# EAGLE design 153-03D LCNC IO expander (EAGLE 6.6.0)
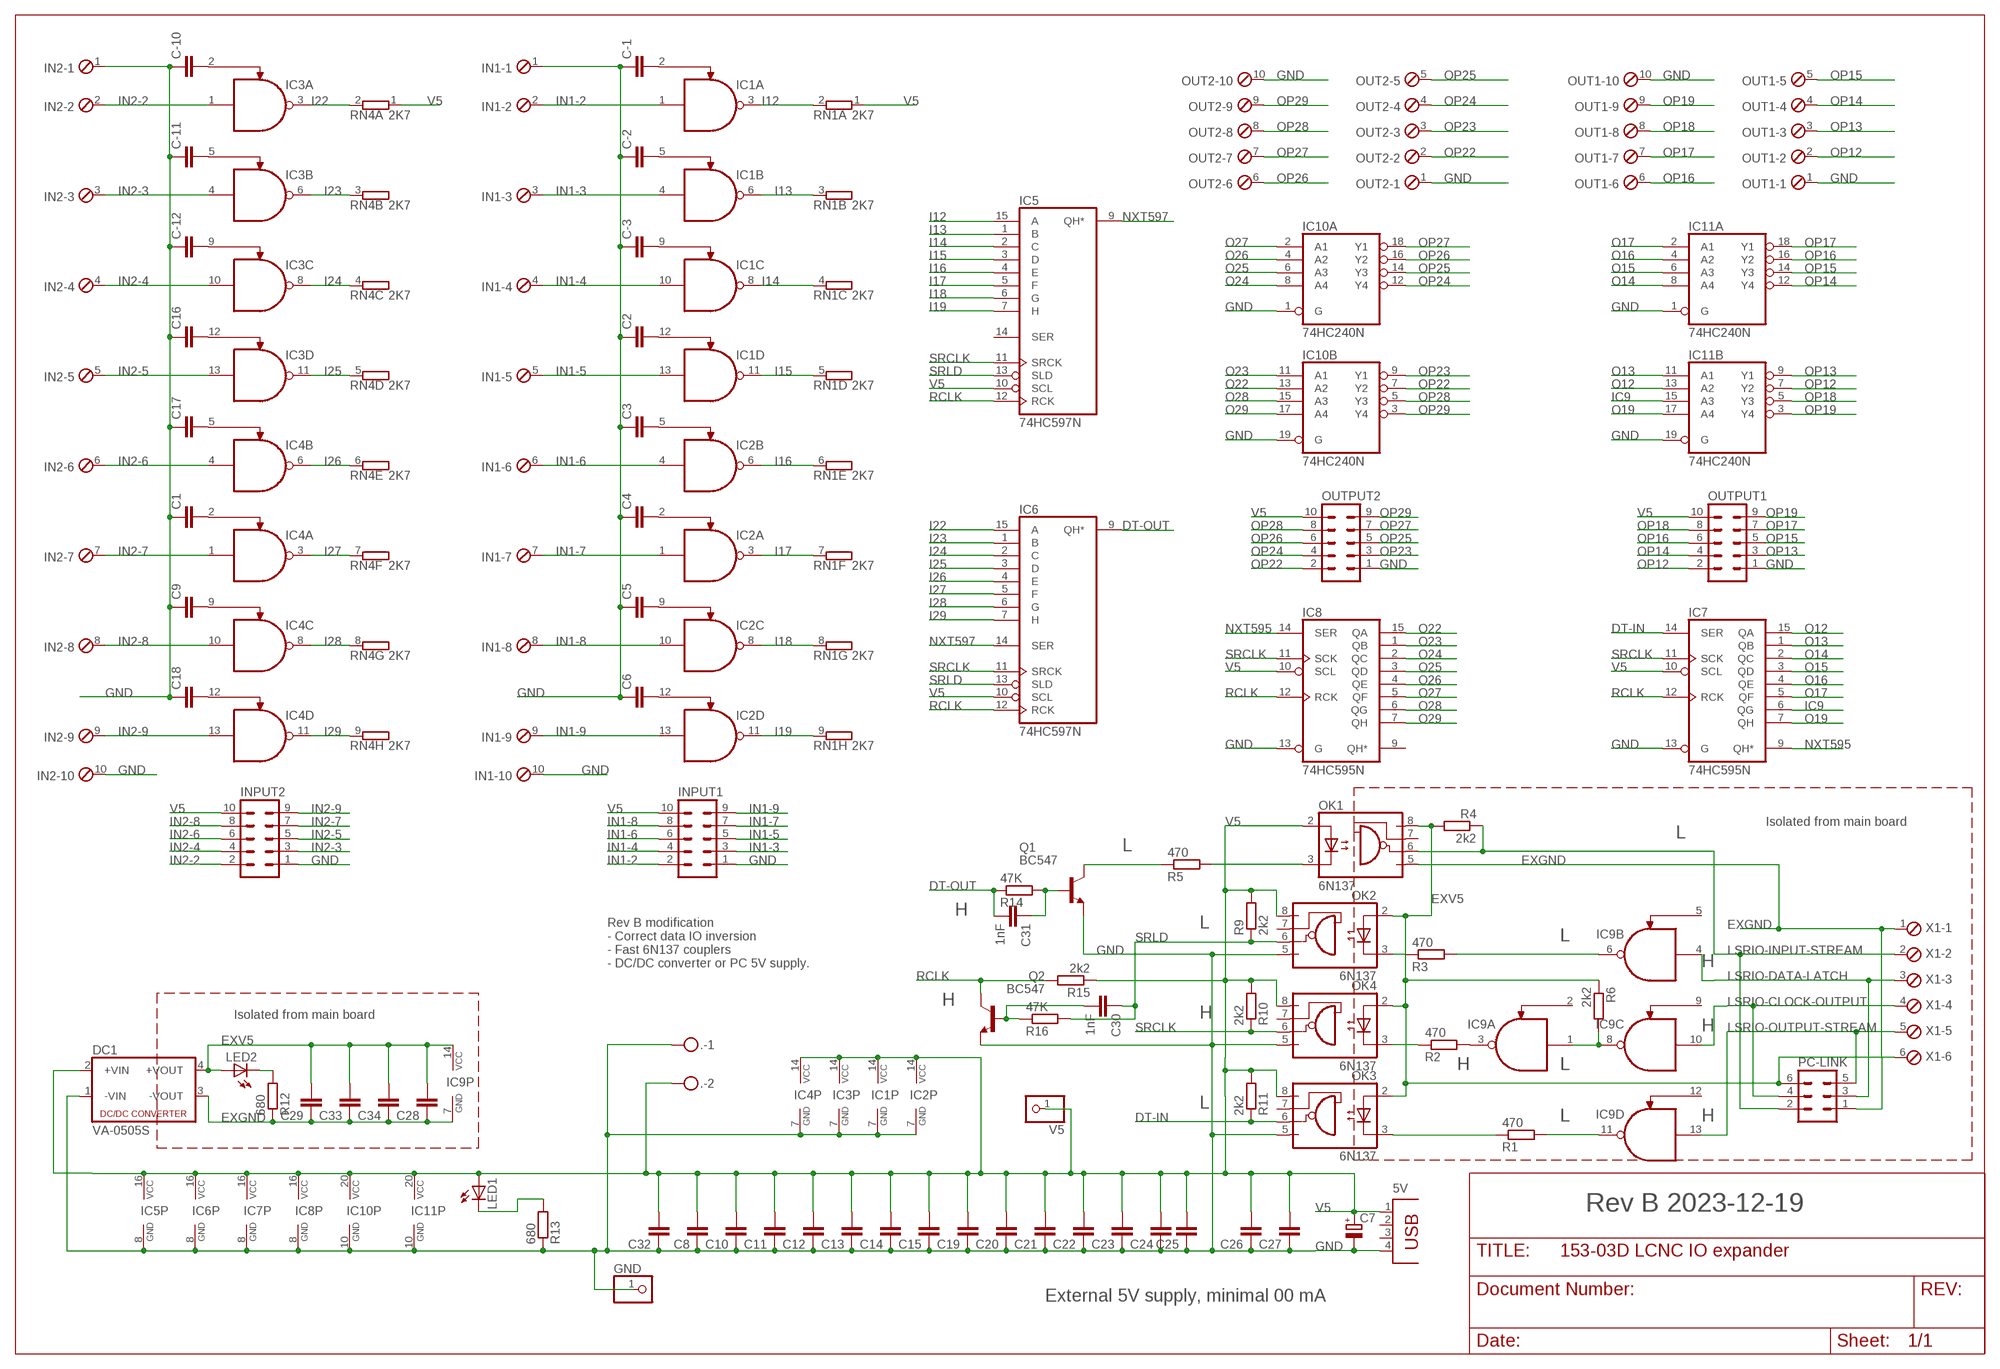
[diagram p0: schematic, sheet 1]

## Parts
5V  PN87520  [PN87520]
.  MKDSN1,5/2-5,08  [MKDSN1,5/2-5,08]
C1  C-EU025-024X044  [C025-024X044]
C2  C-EU025-024X044  [C025-024X044]
C3  C-EU025-024X044  [C025-024X044]
C4  C-EU025-024X044  [C025-024X044]
C5  C-EU025-024X044  [C025-024X044]
C6  C-EU025-024X044  [C025-024X044]
C7  CPOL-EUE3.5-8  [E3,5-8]
C8  C-EU025-024X044  [C025-024X044]
C9  C-EU025-024X044  [C025-024X044]
C10  C-EU025-024X044  [C025-024X044]
C11  C-EU025-024X044  [C025-024X044]
C12  C-EU025-024X044  [C025-024X044]
C13  C-EU025-024X044  [C025-024X044]
C14  C-EU025-024X044  [C025-024X044]
C15  C-EU025-024X044  [C025-024X044]
C16  C-EU025-024X044  [C025-024X044]
C17  C-EU025-024X044  [C025-024X044]
C18  C-EU025-024X044  [C025-024X044]
C19  C-EU025-024X044  [C025-024X044]
C20  C-EU025-024X044  [C025-024X044]
C21  C-EU025-024X044  [C025-024X044]
C22  C-EU025-024X044  [C025-024X044]
C23  C-EU025-024X044  [C025-024X044]
C24  C-EU025-024X044  [C025-024X044]
C25  C-EU025-024X044  [C025-024X044]
C26  C-EU025-024X044  [C025-024X044]
C27  C-EU025-024X044  [C025-024X044]
C28  C-EU025-024X044  [C025-024X044]
C29  C-EU025-024X044  [C025-024X044]
C30  1nF  C-EU025-024X044  [C025-024X044]
C31  1nF  C-EU025-024X044  [C025-024X044]
C32  C-EU025-024X044  [C025-024X044]
C33  C-EU025-024X044  [C025-024X044]
C34  C-EU025-024X044  [C025-024X044]
C-1  C-EU025-024X044  [C025-024X044]
C-2  C-EU025-024X044  [C025-024X044]
C-3  C-EU025-024X044  [C025-024X044]
C-10  C-EU025-024X044  [C025-024X044]
C-11  C-EU025-024X044  [C025-024X044]
C-12  C-EU025-024X044  [C025-024X044]
DC1  VA-0505S  [4SIL]
GND  PINHD-1X1  [1X01]
IC1  MC1489DIP  [DIL14]
IC2  MC1489DIP  [DIL14]
IC3  MC1489DIP  [DIL14]
IC4  MC1489DIP  [DIL14]
IC5  74HC597N  [DIL16]
IC6  74HC597N  [DIL16]
IC7  74HC595N  [DIL16]
IC8  74HC595N  [DIL16]
IC9  MC1489DIP  [DIL14]
IC10  74HC240N  [DIL20]
IC11  74HC240N  [DIL20]
IN1  MPT10  [10POL254]
IN2  MPT10  [10POL254]
INPUT1  ML10  [ML10]
INPUT2  ML10  [ML10]
LED1  LED3MM  [LED3MM]
LED2  LED3MM  [LED3MM]
OK1  6N137  [DIL08]
OK2  6N137  [DIL08]
OK3  6N137  [DIL08]
OK4  6N137  [DIL08]
OUT1  MPT10  [10POL254]
OUT2  MPT10  [10POL254]
OUTPUT1  ML10  [ML10]
OUTPUT2  ML10  [ML10]
PC-LINK  ML6  [ML6]
Q1  BC547  [TO92]
Q2  BC547  [TO92]
R1  470  R-EU_0207/10  [0207/10]
R2  470  R-EU_0207/10  [0207/10]
R3  470  R-EU_0207/10  [0207/10]
R4  2k2  R-EU_0207/10  [0207/10]
R5  470  R-EU_0207/10  [0207/10]
R6  2k2  R-EU_0207/10  [0207/10]
R9  2k2  R-EU_0207/10  [0207/10]
R10  2k2  R-EU_0207/10  [0207/10]
R11  2k2  R-EU_0207/10  [0207/10]
R12  680  R-EU_0207/10  [0207/10]
R13  680  R-EU_0207/10  [0207/10]
R14  47K  R-EU_0207/10  [0207/10]
R15  2k2  R-EU_0207/10  [0207/10]
R16  47K  R-EU_0207/10  [0207/10]
RN1  2K7  GE08R  [SIL9]
RN4  2K7  GE08R  [SIL9]
V5  PINHD-1X1  [1X01]
X1  MPT6  [6POL254]

## Nets
DT-IN: IC7.14(SER) OK3.6(VO) R11.1
DT-OUT: C31.2 IC6.9(QH*) R14.1
EXGND: C28.1 C29.1 C33.1 C34.1 DC1.3(-VOUT) IC9.7(P:GND) OK1.5(GND) PC-LINK.1 R12.1 X1.1
EXV5: C28.2 C29.2 C33.2 C34.2 DC1.4(+VOUT) IC9.14(P:VCC) LED2.A OK1.8(VCC) OK2.2(A) OK3.2(A) OK4.2(A) PC-LINK.6 R4.2 R6.1 X1.6
GND: 5V.4 ..1 C1.1 C2.1 C3.1 C4.1 C5.1 C6.1 C7.- C8.1 C9.1 C10.1 C11.1 C12.1 C13.1 C14.1 C15.1 C16.1 C17.1 C18.1 C19.1 C20.1 C21.1 C22.1 C23.1 C24.1 C25.1 C26.1 C27.1 C32.1 C-1.1 C-2.1 C-3.1 C-10.1 C-11.1 C-12.1 DC1.1(-VIN) GND.1 IC1.7(P:GND) IC2.7(P:GND) IC3.7(P:GND) IC4.7(P:GND) IC5.8(GND) IC6.8(GND) IC7.8(GND) IC7.13(G) IC8.8(GND) IC8.13(G) IC10.1(A:G) IC10.10(P:GND) IC10.19(B:G) IC11.1(A:G) IC11.10(P:GND) IC11.19(B:G) IN1.1 IN1.10 IN2.1 IN2.10 INPUT1.1 INPUT2.1 OK2.5(GND) OK3.5(GND) OK4.5(GND) OUT1.1 OUT1.10 OUT2.1 OUT2.10 OUTPUT1.1 OUTPUT2.1 Q1.1(E) Q2.1(E) R13.1
I12: IC1.3(A:O) IC5.15(A) RN1.2
I13: IC1.6(B:O) IC5.1(B) RN1.3
I14: IC1.8(C:O) IC5.2(C) RN1.4
I15: IC1.11(D:O) IC5.3(D) RN1.5
I16: IC2.6(B:O) IC5.4(E) RN1.6
I17: IC2.3(A:O) IC5.5(F) RN1.7
I18: IC2.8(C:O) IC5.6(G) RN1.8
I19: IC2.11(D:O) IC5.7(H) RN1.9
I22: IC3.3(A:O) IC6.15(A) RN4.2
I23: IC3.6(B:O) IC6.1(B) RN4.3
I24: IC3.8(C:O) IC6.2(C) RN4.4
I25: IC3.11(D:O) IC6.3(D) RN4.5
I26: IC4.6(B:O) IC6.4(E) RN4.6
I27: IC4.3(A:O) IC6.5(F) RN4.7
I28: IC4.8(C:O) IC6.6(G) RN4.8
I29: IC4.11(D:O) IC6.7(H) RN4.9
IC9: IC7.6(QG) IC11.15(B:A3)
IN1-2: IC1.1(A:I0) IN1.2 INPUT1.2
IN1-3: IC1.4(B:I0) IN1.3 INPUT1.3
IN1-4: IC1.10(C:I0) IN1.4 INPUT1.4
IN1-5: IC1.13(D:I0) IN1.5 INPUT1.5
IN1-6: IC2.4(B:I0) IN1.6 INPUT1.6
IN1-7: IC2.1(A:I0) IN1.7 INPUT1.7
IN1-8: IC2.10(C:I0) IN1.8 INPUT1.8
IN1-9: IC2.13(D:I0) IN1.9 INPUT1.9
IN2-2: IC3.1(A:I0) IN2.2 INPUT2.2
IN2-3: IC3.4(B:I0) IN2.3 INPUT2.3
IN2-4: IC3.10(C:I0) IN2.4 INPUT2.4
IN2-5: IC3.13(D:I0) IN2.5 INPUT2.5
IN2-6: IC4.4(B:I0) IN2.6 INPUT2.6
IN2-7: IC4.1(A:I0) IN2.7 INPUT2.7
IN2-8: IC4.10(C:I0) IN2.8 INPUT2.8
IN2-9: IC4.13(D:I0) IN2.9 INPUT2.9
LSRIO-CLOCK-OUTPUT: IC9.10(C:I0) PC-LINK.4 X1.4
LSRIO-DATA-LATCH: IC9.4(B:I0) PC-LINK.3 X1.3
LSRIO-INPUT-STREAM: OK1.6(VO) PC-LINK.2 R4.1 X1.2
LSRIO-OUTPUT-STREAM: IC9.13(D:I0) PC-LINK.5 X1.5
N$1: C-2.2 IC1.5(B:I1)
N$2: OK3.3(C) R1.1
N$3: C-10.2 IC3.2(A:I1)
N$4: IC9.6(B:O) R3.2
N$5: C17.2 IC4.5(B:I1)
N$6: C31.1 Q1.2(B) R14.2
N$7: C-3.2 IC1.9(C:I1)
N$8: IC9.11(D:O) R1.2
N$9: C30.2 Q2.2(B) R16.1
N$10: C1.2 IC4.2(A:I1)
N$11: C9.2 IC4.9(C:I1)
N$12: C18.2 IC4.12(D:I1)
N$13: IC9.3(A:O) R2.2
N$14: OK2.3(C) R3.1
N$16: Q1.3(C) R5.1
N$17: OK1.3(C) R5.2
N$18: OK4.3(C) R2.1
N$19: C2.2 IC1.12(D:I1)
N$20: C4.2 IC2.2(A:I1)
N$21: C5.2 IC2.9(C:I1)
N$22: C6.2 IC2.12(D:I1)
N$23: C-1.2 IC1.2(A:I1)
N$24: C3.2 IC2.5(B:I1)
N$25: IC9.1(A:I0) IC9.8(C:O) R6.2
N$27: LED2.K(C) R12.2
N$28: LED1.K(C) R13.2
N$39: C-11.2 IC3.5(B:I1)
N$40: C-12.2 IC3.9(C:I1)
N$42: C16.2 IC3.12(D:I1)
NXT595: IC7.9(QH*) IC8.14(SER)
NXT597: IC5.9(QH*) IC6.14(SER)
O12: IC7.15(QA) IC11.13(B:A2)
O13: IC7.1(QB) IC11.11(B:A1)
O14: IC7.2(QC) IC11.8(A:A4)
O15: IC7.3(QD) IC11.6(A:A3)
O16: IC7.4(QE) IC11.4(A:A2)
O17: IC7.5(QF) IC11.2(A:A1)
O19: IC7.7(QH) IC11.17(B:A4)
O22: IC8.15(QA) IC10.13(B:A2)
O23: IC8.1(QB) IC10.11(B:A1)
O24: IC8.2(QC) IC10.8(A:A4)
O25: IC8.3(QD) IC10.6(A:A3)
O26: IC8.4(QE) IC10.4(A:A2)
O27: IC8.5(QF) IC10.2(A:A1)
O28: IC8.6(QG) IC10.15(B:A3)
O29: IC8.7(QH) IC10.17(B:A4)
OP12: IC11.7(B:Y2) OUT1.2 OUTPUT1.2
OP13: IC11.9(B:Y1) OUT1.3 OUTPUT1.3
OP14: IC11.12(A:Y4) OUT1.4 OUTPUT1.4
OP15: IC11.14(A:Y3) OUT1.5 OUTPUT1.5
OP16: IC11.16(A:Y2) OUT1.6 OUTPUT1.6
OP17: IC11.18(A:Y1) OUT1.7 OUTPUT1.7
OP18: IC11.5(B:Y3) OUT1.8 OUTPUT1.8
OP19: IC11.3(B:Y4) OUT1.9 OUTPUT1.9
OP22: IC10.7(B:Y2) OUT2.2 OUTPUT2.2
OP23: IC10.9(B:Y1) OUT2.3 OUTPUT2.3
OP24: IC10.12(A:Y4) OUT2.4 OUTPUT2.4
OP25: IC10.14(A:Y3) OUT2.5 OUTPUT2.5
OP26: IC10.16(A:Y2) OUT2.6 OUTPUT2.6
OP27: IC10.18(A:Y1) OUT2.7 OUTPUT2.7
OP28: IC10.5(B:Y3) OUT2.8 OUTPUT2.8
OP29: IC10.3(B:Y4) OUT2.9 OUTPUT2.9
RCLK: IC5.12(RCK) IC6.12(RCK) IC7.12(RCK) IC8.12(RCK) Q2.3(C) R15.2
SRCLK: IC5.11(SRCK) IC6.11(SRCK) IC7.11(SCK) IC8.11(SCK) OK4.6(VO) R10.1
SRLD: C30.1 IC5.13(SLD) IC6.13(SLD) OK2.6(VO) R9.1 R16.2
V5: 5V.1 ..2 C7.+ C8.2 C10.2 C11.2 C12.2 C13.2 C14.2 C15.2 C19.2 C20.2 C21.2 C22.2 C23.2 C24.2 C25.2 C26.2 C27.2 C32.2 DC1.2(+VIN) IC1.14(P:VCC) IC2.14(P:VCC) IC3.14(P:VCC) IC4.14(P:VCC) IC5.10(SCL) IC5.16(VCC) IC6.10(SCL) IC6.16(VCC) IC7.10(SCL) IC7.16(VCC) IC8.10(SCL) IC8.16(VCC) IC10.20(P:VCC) IC11.20(P:VCC) INPUT1.10 INPUT2.10 LED1.A OK1.2(A) OK2.8(VCC) OK3.8(VCC) OK4.8(VCC) OUTPUT1.10 OUTPUT2.10 R9.2 R10.2 R11.2 R15.1 RN1.1 RN4.1 V5.1
Unconnected: 5V.2 5V.3 IC5.14(SER) IC8.9(QH*) IC9.2(A:I1) IC9.5(B:I1) IC9.9(C:I1) IC9.12(D:I1) OK1.7(VE) OK2.7(VE) OK3.7(VE) OK4.7(VE)

## Notes on the sheet
- Isolated from main board
- L
- L
- H
- L
- L
- Rev B modification
  - Correct data IO inversion
  - Fast 6N137 couplers
  - DC/DC converter or PC 5V supply.
- H
- H
- Isolated from main board | H
- H
- H | L
- L
- L | H
- Rev B 2023-12-19
- External 5V supply, minimal 00 mA

## Library data of the parts
5V = con-berg:PN87520: BERG USB connector; OC_FARNELL: unknown; OC_NEWARK: unknown
. = con-phoenix-508:MKDSN1,5/2-5,08: MKDSN 1,5/ 2-5,08 Printklemme Nennstrom: 13,5 A Nennspannung: 250 V Rastermaß: 5,08 mm Polzahl: 2 Anschlussart: Schraubanschluss Montage: Löten Anschlussrichtung Leiter/Platine: 0 ° Artikelnummer: 1729128 Source: http://eshop.phoenixcontact.com .. 1729128.pdf
C1-C6 C8-C34 C-1-C-3 C-10-C-12 = rcl:C-EU: CAPACITOR, European symbol
C7 = rcl:CPOL-EU: POLARIZED CAPACITOR, European symbol
DC1 = dc-dc-converter:VA-*?: DC DC Converter Single Output, 1 Watt Motien Technology Co.,Ltd. Source: Data sheet <http://www.motien.com.tw/data_sheet/VA-1%28H%29.pdf>; OC_FARNELL: unknown; OC_NEWARK: unknown
GND V5 = pinhead:PINHD-1X1: PIN HEADER
IC1-IC4 IC9 = My components:MC1489DIP: MC1489 quad line receiver DIP14
IC5 IC6 = 74xx-eu:74*597: 8-bit SHIFT REGISTER, input latch
IC7 IC8 = 74xx-eu:74*595: 8-bit SHIFT REGISTER, output latch
IC10 IC11 = 74xx-eu:74*240: Octal BUFFER and LINE DRIVER, 3-state
IN1 IN2 OUT1 OUT2 = con-phoenix-254:MPT10: PHOENIX CONNECTOR; OC_FARNELL: unknown; OC_NEWARK: unknown
INPUT1 INPUT2 OUTPUT1 OUTPUT2 = con-harting-ml:ML10: HARTING; OC_FARNELL: unknown; OC_NEWARK: unknown
LED1 LED2 = led:LED: LED OSRAM: - CHIPLED LG R971, LG N971, LY N971, LG Q971, LY Q971, LO R971, LY R971 LH N974, LH R974 LS Q976, LO Q976, LY Q976 LO Q996 - Hyper CHIPLED LW Q18S LB Q993, LB Q99A, LB R99A - SideLED LS A670, LO A670, LY A670, LG A670, LP A670 LB A673, LV A673, LT A673, LW A673 LH A674 LY A675 LS A676, LA A676, LO A676, LY A676, LW A676 LS A679, LY A679, LG A679 - Hyper Micro SIDELED® LS Y876, LA Y876, LO Y876, LY Y876 LT Y87S - SmartLED LW L88C, LW L88S LB L89C, LB L89S, LG L890 LS L89K, LO L89K, LY L89K LS L896, LA L896, LO L896, LY L896 - TOPLED LS T670, LO T670, LY T670, LG T670, LP T670 LSG T670, LSP T670, LSY T670, LOP T670, LYG T670 LG T671, LOG T671, LSG T671 LB T673, LV T673, LT T673, LW T673 LH T674 LS T676, LA T676, LO T676, LY T676, LB T676, LH T676, LSB T676, LW T676 LB T67C, LV T67C, LT T67C, LS T67K, LO T67K, LY T67K, LW E67C LS E67B, LA E67B, LO E67B, LY E67B, LB E67C, LV E67C, LT E67C LW T67C LS T679, LY T679, LG T679 LS T770, LO T770, LY T770, LG T770, LP T770 LB T773, LV T773, LT T773, LW T773 LH T774 LS E675, LA E675, LY E675, LS T675 LS T776, LA T776, LO T776, LY T776, LB T776 LHGB T686 LT T68C, LB T68C - Hyper Mini TOPLED® LB M676 - Mini TOPLED Santana® LG M470 LS M47K, LO M47K, LY M47K Source: http://www.osram.convergy.de LUXEON: - LUMILED® LXK2-PW12-R00, LXK2-PW12-S00, LXK2-PW14-U00, LXK2-PW14-V00 LXK2-PM12-R00, LXK2-PM12-S00, LXK2-PM14-U00 LXK2-PE12-Q00, LXK2-PE12-R00, LXK2-PE12-S00, LXK2-PE14-T00, LXK2-PE14-U00 LXK2-PB12-K00, LXK2-PB12-L00, LXK2-PB12-M00, LXK2-PB14-N00, LXK2-PB14-P00, LXK2-PB14-Q00 LXK2-PR12-L00, LXK2-PR12-M00, LXK2-PR14-Q00, LXK2-PR14-R00 LXK2-PD12-Q00, LXK2-PD12-R00, LXK2-PD12-S00 LXK2-PH12-R00, LXK2-PH12-S00 LXK2-PL12-P00, LXK2-PL12-Q00, LXK2-PL12-R00 Source: www.luxeon.com KINGBRIGHT: KA-3528ASYC Source: www.kingbright.com
OK1-OK4 = optocoupler:6N137: MOTOROLA OPTO COUPLER; MPN: 6N137; OC_FARNELL: 1328376; OC_NEWARK: 52M1895
PC-LINK = con-harting-ml:ML6: HARTING; OC_FARNELL: unknown; OC_NEWARK: unknown
Q1 Q2 = transistor-npn:BC547*: NPN Transistor
R1-R6 R9-R16 = rcl:R-EU_: RESISTOR, European symbol
RN1 RN4 = resistor-sil:GE08R: SIL RESISTOR; OC_FARNELL: unknown; OC_NEWARK: unknown
X1 = con-phoenix-254:MPT6: PHOENIX CONNECTOR; OC_FARNELL: unknown; OC_NEWARK: unknown

## Board
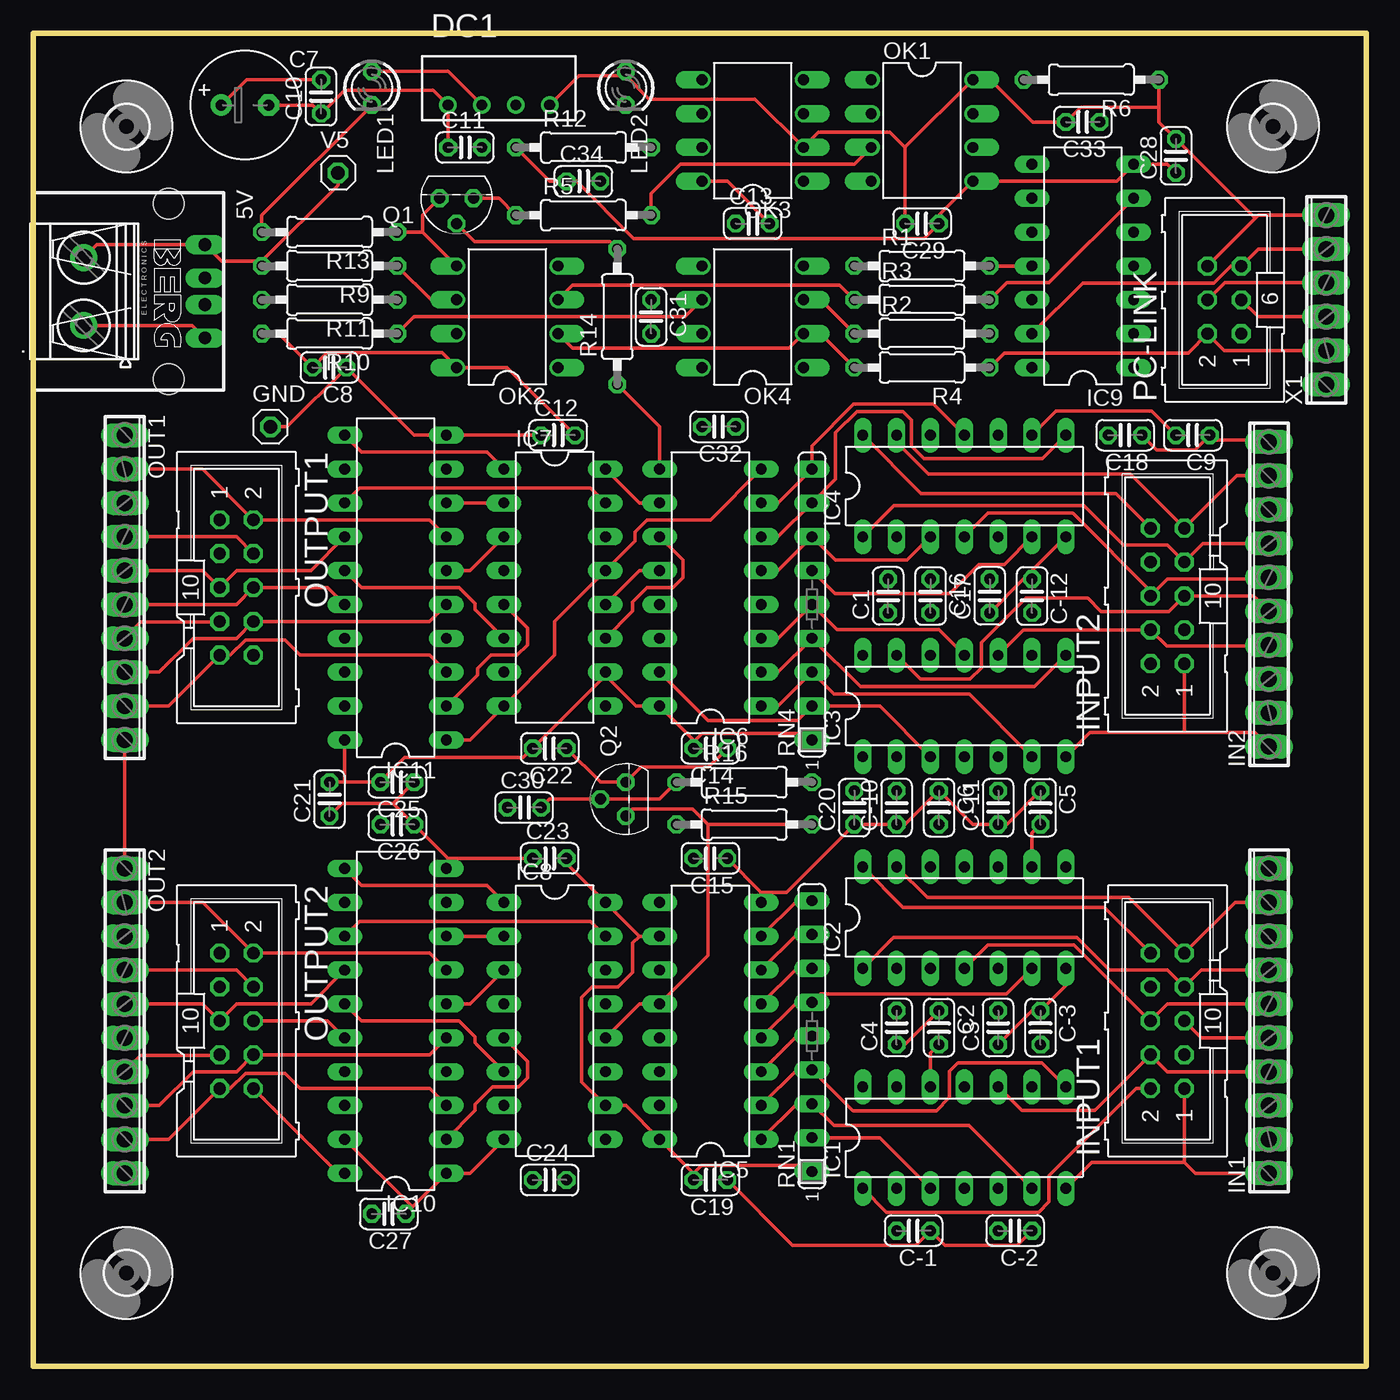
[diagram p1: board, top side]
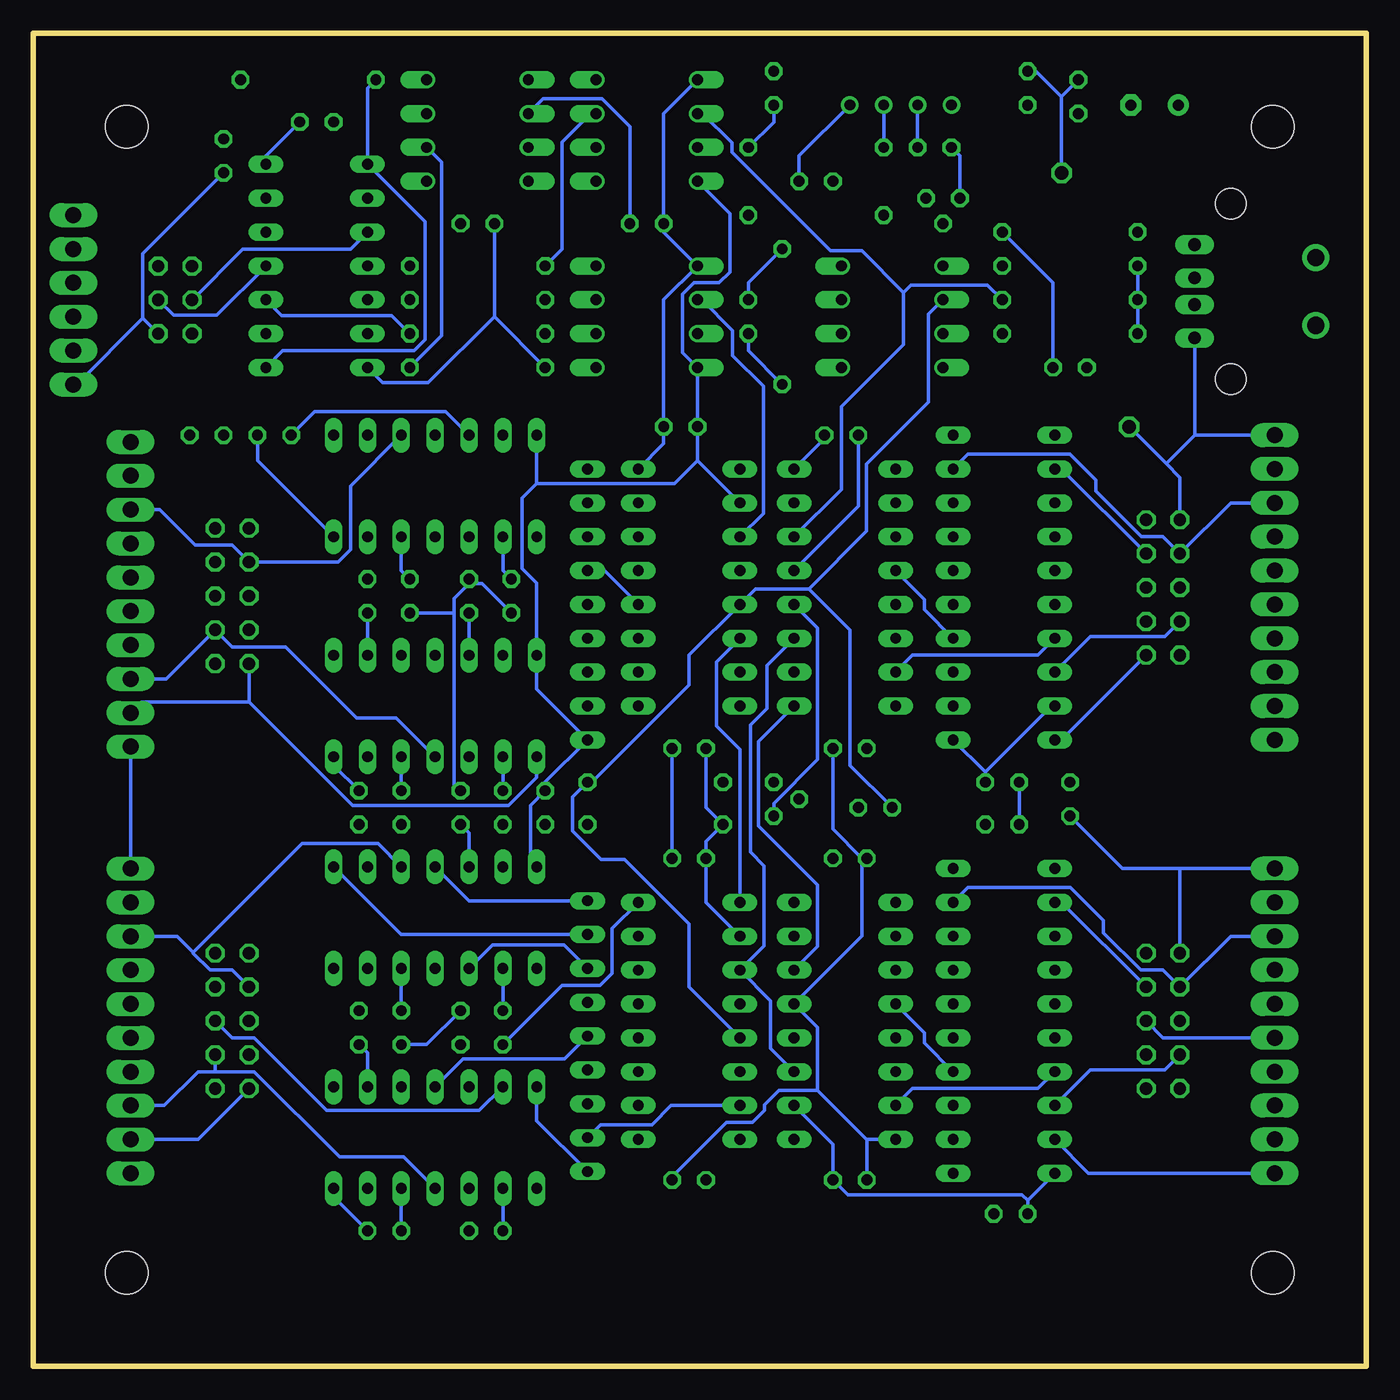
[diagram p2: board, bottom side, seen from below]

Size 100 x 100 mm. Coordinates in mm from the lower left corner, seen from the top.
Outline: 100,100 100,0 50,0 0,0 0,100 50,100 100,100
Copper layers (1*16): Top 0.035mm / dielectric 1.5mm / Bottom 0.035mm
Design rules "default *": minimum track width 10mil, minimum drill 24mil, track to track 12mil, track to pad 12mil, pad to pad 15mil, via to via 8mil, smd to smd 8mil, copper to edge 20mil, drill to drill 15mil, minimum pad ring 10mil, minimum via ring 8mil, stop-mask expansion 4mil, vias tented up to drill 0mil, thermal gap 10mil

### Footprints (pad centres in the part's own frame; a part is rotated, then mirrored left to right if it is on the bottom)
PN87520 = drill 0.95 long: 1 -3.5,2.71; 2 -1,2.71; 3 1,2.71; 4 3.5,2.71 | hole 2.3: -6.57,0; 6.57,0
MKDSN1,5/2-5,08 = drill 1.3 pad 2: 1 -2.561,0.025; 2 2.519,0.025
C025-024X044 = drill 0.813 octagon: 1 -1.27,0; 2 1.27,0
E3,5-8 = drill 0.813 pad 1.6: + -1.778,0 | drill 0.813 pad 1.6 octagon: - 1.778,0
4SIL = drill 0.8: 1 -3.81,0; 2 -1.27,0; 3 1.27,0; 4 3.81,0
1X01 = drill 1.016 octagon: 1 0,0
DIL14 = drill 0.813 long: 1 -7.62,-3.81; 2 -5.08,-3.81; 3 -2.54,-3.81; 4 0,-3.81; 5 2.54,-3.81; 6 5.08,-3.81; 7 7.62,-3.81; 8 7.62,3.81; 9 5.08,3.81; 10 2.54,3.81; 11 0,3.81; 12 -2.54,3.81; 13 -5.08,3.81; 14 -7.62,3.81
DIL16 = drill 0.813 long: 1 -8.89,-3.81; 2 -6.35,-3.81; 3 -3.81,-3.81; 4 -1.27,-3.81; 5 1.27,-3.81; 6 3.81,-3.81; 7 6.35,-3.81; 8 8.89,-3.81; 9 8.89,3.81; 10 6.35,3.81; 11 3.81,3.81; 12 1.27,3.81; 13 -1.27,3.81; 14 -3.81,3.81; 15 -6.35,3.81; 16 -8.89,3.81
DIL20 = drill 0.813 long: 1 -11.43,-3.81; 2 -8.89,-3.81; 3 -6.35,-3.81; 4 -3.81,-3.81; 5 -1.27,-3.81; 6 1.27,-3.81; 7 3.81,-3.81; 8 6.35,-3.81; 9 8.89,-3.81; 10 11.43,-3.81; 11 11.43,3.81; 12 8.89,3.81; 13 6.35,3.81; 14 3.81,3.81; 15 1.27,3.81; 16 -1.27,3.81; 17 -3.81,3.81; 18 -6.35,3.81; 19 -8.89,3.81; 20 -11.43,3.81
10POL254 = drill 1.2 long: 1 -11.43,0; 2 -8.89,0; 3 -6.35,0; 4 -3.81,0; 5 -1.27,0; 6 1.27,0; 7 3.81,0; 8 6.35,0; 9 8.89,0; 10 11.43,0
ML10 = drill 0.914 octagon: 1 -5.08,-1.27; 2 -5.08,1.27; 3 -2.54,-1.27; 4 -2.54,1.27; 5 0,-1.27; 6 0,1.27; 7 2.54,-1.27; 8 2.54,1.27; 9 5.08,-1.27; 10 5.08,1.27
LED3MM = drill 0.813 octagon: A -1.27,0; K 1.27,0
DIL08 = drill 0.813 offset: 1 -3.81,-3.81; 2 -1.27,-3.81; 3 1.27,-3.81; 4 3.81,-3.81; 5 3.81,3.81; 6 1.27,3.81; 7 -1.27,3.81; 8 -3.81,3.81
ML6 = drill 0.914 octagon: 1 -2.54,-1.27; 2 -2.54,1.27; 3 0,-1.27; 4 0,1.27; 5 2.54,-1.27; 6 2.54,1.27
TO92 = drill 0.813 octagon: 1 1.27,0; 2 0,1.905; 3 -1.27,0
0207/10 = drill 0.813 octagon: 1 -5.08,0; 2 5.08,0
SIL9 = drill 0.813 long: 1 -10.16,0; 2 -7.62,0; 3 -5.08,0; 4 -2.54,0; 5 0,0; 6 2.54,0; 7 5.08,0; 8 7.62,0; 9 10.16,0
3,2 = hole 3.2: 0,0
6POL254 = drill 1.2 pad 1.778 long: 1 -6.35,0; 2 -3.81,0; 3 -1.27,0; 4 1.27,0; 5 3.81,0; 6 6.35,0

### Placement (x,y rotation side)
5V  10.16,80.64 270 top
.  3.81,80.64 90 top
C1  64.14,57.78 90 top
C2  67.94,25.4 270 top
C3  72.39,25.4 90 top
C4  64.77,25.4 90 top
C5  75.56,41.91 270 top
C6  67.94,41.91 270 top
C7  15.88,94.61 0 top
C8  22.23,74.93 180 top
C9  87,69.85 180 top
C10  21.59,95.25 90 top
C11  32.38,91.44 0 top
C12  39.37,69.85 0 top
C13  53.98,85.72 0 top
C14  50.8,46.35 180 top
C15  50.8,38.1 180 top
C16  67.31,57.78 270 top
C17  71.75,57.78 90 top
C18  81.92,69.85 180 top
C19  50.8,13.97 180 top
C20  61.59,41.91 90 top
C21  22.23,42.55 90 top
C22  38.73,46.35 180 top
C23  38.73,38.1 0 top
C24  38.73,13.97 0 top
C25  27.3,43.81 180 top
C26  27.3,40.64 180 top
C27  26.67,11.43 180 top
C28  85.72,90.81 90 top
C29  66.67,85.72 180 top
C30  36.83,41.91 0 top
C31  46.35,78.74 270 top
C32  51.44,70.48 180 top
C33  78.74,93.34 180 top
C34  41.27,88.9 0 top
C-1  66.04,10.16 180 top
C-2  73.66,10.16 180 top
C-3  75.56,25.4 270 top
C-10  64.77,41.91 90 top
C-11  72.39,41.91 90 top
C-12  74.93,57.78 270 top
DC1  34.92,94.61 0 top
GND  17.78,70.48 0 top
IC1  69.85,17.14 0 top
IC2  69.85,33.66 0 top
IC3  69.85,49.53 0 top
IC4  69.85,66.04 0 top
IC5  50.8,25.91 90 top
IC6  50.8,58.42 90 top
IC7  39.12,58.42 270 top
IC8  39.12,25.91 270 top
IC9  78.74,82.55 90 top
IC10  27.18,25.91 90 top
IC11  27.18,58.42 90 top
IN1  92.71,25.91 90 top
IN2  92.71,57.91 90 top
INPUT1  85.09,25.91 90 top
INPUT2  85.09,57.78 90 top
LED1  25.4,95.89 270 top
LED2  44.45,95.89 270 top
OK1  66.67,92.71 270 top
OK2  35.56,78.74 90 top
OK3  53.98,92.71 90 top
OK4  53.98,78.74 90 top
OUT1  6.86,58.42 270 top
OUT2  6.86,25.91 270 top
OUTPUT1  15.24,58.42 270 top
OUTPUT2  15.24,25.91 270 top
PC-LINK  89.36,80 90 top
Q1  31.75,87.63 180 top
Q2  44.45,42.55 90 top
R1  66.67,82.55 0 top
R2  66.67,77.47 0 top
R3  66.67,80.01 0 top
R4  66.67,74.93 180 top
R5  41.27,86.36 0 top
R6  79.38,96.52 180 top
R9  22.23,82.55 180 top
R10  22.23,77.47 180 top
R11  22.23,80.01 180 top
R12  41.27,91.44 0 top
R13  22.23,85.09 180 top
R14  43.81,78.74 90 top
R15  53.34,40.64 0 top
R16  53.34,43.81 0 top
RN1  58.42,24.77 90 top
RN4  58.42,57.15 90 top
U$1  [3,2]  7,7 0 top
U$2  [3,2]  93,7 0 top
U$3  [3,2]  93,93 0 top
U$4  [3,2]  7,93 0 top
V5  22.86,89.53 0 top
X1  97,80.01 90 top

### Tracks (layer width: path | path; a pad name or v marks a point on that pad's centre or on a via)
DT-IN
  Bottom 0.254: 34.7,80.56 34.7,76.66 39.37,71.99 39.37,65.79 IC7.14 | 34.7,80.56 37.82,83.68 40.21,83.68 47.6,91.07 47.6,91.79 49.79,93.98 OK3.6 | R11.1 28.4,81.11 34.15,81.11 34.7,80.56
DT-OUT
  Top 0.254: R14.1 46.99,70.48 IC6.9
  Bottom 0.254: R14.1 46.35,76.2 C31.2
EXGND
  Top 0.254: R12.1 38.73,88.9 C34.1 40.74,88.9 45.04,84.6 66.82,84.6 C29.1 67.94,86.36 OK1.5 81.28,88.9 IC9.7 85.09,90.17 C28.1
  Bottom 0.254: 91.8,78.62 PC-LINK.1 | C28.1 91.8,83.46 91.8,78.62 | X1.1 96.76,73.66 91.8,78.62 | C33.1 82.55,90.81 IC9.7 | R12.1 DC1.3
EXV5
  Top 0.254: 91.68,86.12 PC-LINK.6 | X1.6 91.92,86.36 91.68,86.12 | 91.68,86.12 C28.2 84.45,93.34 84.45,94.47 | 84.45,94.47 R6.1 | 84.45,94.47 78.59,94.47 C33.2 74.98,93.34 71.81,96.52 OK1.8 65.41,91.44 | 65.41,91.44 C29.2 | 65.41,91.44 64.28,92.57 58.91,92.57 OK3.2 54.15,95.07 46.19,95.07 44.45,96.81 | 44.45,96.81 40.93,96.81 DC1.4 | 44.45,96.81 LED2.A | OK2.2 40.47,76.37 56.68,76.37 OK4.2 59.05,77.47 R4.2
  Bottom 0.254: 65.41,78.74 C29.2 | R4.2 65.41,78.74 | 65.41,78.74 70.36,73.78 73.78,73.78 IC9.14 | DC1.4 42.55,90.81 C34.2
GND
  Top 0.254: C5.1 73.03,40.64 C-11.1 70.48,40.64 C6.1 65.41,40.64 C-10.1 C20.1 56.52,35.56 54.61,35.56 | IC6.8 50.8,63.5 46.04,63.5 45.14,62.6 45.14,61.9 IC7.13 39.12,55.88 39.12,53.34 IC7.8 32.77,46.99 IC11.1 | C11.1 DC1.1 30,95.73 23.34,95.73 C10.1 20.95,94.61 C7.- | IC4.7 74.93,59.69 C-12.1 74.3,59.05 C17.1 | C2.1 65.41,24.13 C4.1 | IC8.8 32.77,14.48 IC10.1 28.45,11.94 | GND.1 19.05,70.48 C8.1 28.57,69.85 IC11.10 C12.1 | C19.1 56.97,9.07 66.22,9.07 C-1.1 68.4,9.07 73.84,9.07 C-2.1 | C14.1 50.67,44.95 45.59,44.95 Q2.1 42.55,43.81 C22.1 | 26.99,42.23 C26.1 31.11,38.1 | 26.99,42.23 C25.1 | C21.1 23.18,42.23 26.99,42.23 | 28.45,11.94 C27.1 | 28.45,11.94 IC10.19 | OUT2.1 OUT1.10 | 54.61,35.56 IC5.8 | C15.1 54.61,35.56 | C23.1 31.11,38.1 | 31.11,38.1 31.11,37.47 IC10.10 | 29.21,85.09 OK2.5 | R13.1 29.21,85.09 | 29.21,85.09 29.21,86.36 Q1.1 | 5V.4 11.93,78.08 ..1 | C3.1 74.93,26.67 C-3.1 77.47,28.57 IC2.7 | C18.1 84.3,68.73 87.15,68.73 C9.1 88.65,69.46 92.59,69.46 | 86.36,15.3 79.43,15.3 IC1.7 | IN1.1 87.18,14.48 86.36,15.3 | INPUT1.1 86.36,15.3 | 86.36,47.53 79.28,47.53 IC3.7 | IN2.1 91.66,47.53 86.36,47.53 | INPUT2.1 86.36,47.53 | IN2.10 92.59,69.46 | 92.59,69.46
  Bottom 0.254: 68.42,56.52 68.42,57.6 67.31,58.71 | C17.1 68.42,56.52 | C6.1 68.42,43.66 68.42,56.52 | 37.47,16.99 C24.1 | 41.17,20.7 37.47,16.99 | IC8.8 37.44,17.02 37.47,16.99 | C19.1 52.07,14.22 48.01,18.29 46.04,18.29 45.14,19.19 45.14,19.6 44.04,20.7 41.17,20.7 | 41.17,20.7 41.17,25.42 IC8.13 37.81,32.29 37.81,38.1 | C22.1 40.01,40.29 37.81,38.1 | 37.81,38.1 C23.1 | IC5.8 56.58,32.83 56.58,29.47 57.47,28.57 60.33,28.57 C4.1 | C12.1 38.1,64.52 IC7.13 | 28.57,44.58 C25.1 | IC11.1 28.57,44.58 | 28.57,44.58 23.62,49.53 IC11.19 | C-2.1 77.47,12.7 IC1.7 | C3.1 70.48,24.13 C2.1 | 67.31,58.71 66.33,58.71 C1.1 | C16.1 67.31,58.71 | OUT2.10 20.83,14.48 IC10.19 | 15.01,67.71 GND.1 | OUTPUT1.1 13.97,66.67 15.01,67.71 | 15.01,67.71 12.87,69.85 | 12.87,69.85 OUT1.1 | 12.87,69.85 5V.4 | 13.97,37.34 OUTPUT2.1 | C21.1 18.29,37.34 13.97,37.34 | 13.97,37.34 OUT2.1 | IC4.7 83.19,67.94 C18.1 | R13.1 23.5,81.28 C8.1 | C15.1 C14.1 | IC6.8 52.7,69.22 C32.1 52.7,80.01 OK4.5 52.7,85.09 C13.1 52.7,93.98 OK3.5 | IC3.7 77.47,45.09 C5.1 | IN2.1 IN1.10 | Q1.1 30.48,90.81 C11.1
I12
  Top 0.254: RN1.2 63.5,17.14 IC1.3
  Bottom 0.254: RN1.2 57.45,18.11 53.59,18.11 52.15,19.56 IC5.15
I13
  Top 0.254: IC1.6 70.21,18.05 60.05,18.05 RN1.3 57.28,19.68 IC5.1
I14
  Top 0.254: IC1.8 75.68,22.75 69.38,22.75 68.75,22.11 68.75,20.16 67.75,19.16 61.48,19.16 RN1.4 57.28,22.23 IC5.2
I15
  Top 0.254: RN1.5 57.28,24.77 IC5.3
  Bottom 0.254: RN1.5 60.15,23.04 67.77,23.04 IC1.11
I16
  Top 0.254: IC2.6 73.01,27.93 59.04,27.93 RN1.6 57.28,27.3 IC5.4
I17
  Top 0.254: IC5.5 57.28,29.84 RN1.7
  Bottom 0.254: RN1.7 60.2,31.62 65.53,31.62 IC2.3
I18
  Top 0.254: IC5.6 57.28,32.38 RN1.8
  Bottom 0.254: RN1.8 72.39,32.38 IC2.8
I19
  Top 0.254: RN1.9 57.28,34.92 IC5.7
  Bottom 0.254: RN1.9 67.31,34.92 IC2.11
I22
  Top 0.254: IC6.15 50.62,48.44 57.33,48.44 RN4.2 63.5,49.53 IC3.3
I23
  Top 0.254: IC3.6 70.23,50.42 60.07,50.42 RN4.3 55.88,49.53 IC6.1
I24
  Top 0.254: IC3.8 75.11,50.98 62.05,50.98 RN4.4 55.88,52.07 IC6.2
I25
  Top 0.254: IC3.11 67.93,55.26 60.31,55.26 RN4.5 55.88,54.61 IC6.3
I26
  Top 0.254: RN4.6 60.15,57.96 68.75,57.96 70.94,60.15 72.85,60.15 IC4.6
  Bottom 0.254: IC6.4 57.15,59.69 RN4.6
I27
  Top 0.254: IC4.3 65.55,60.47 60.18,60.47 RN4.7 55.88,59.69 IC6.5
I28
  Top 0.254: IC4.8 75.71,68.09 66.83,68.09 65.87,69.04 65.87,70.97 65.23,71.61 61.78,71.61 60.19,70.03 60.19,66.54 RN4.8 55.88,62.23 IC6.6
I29
  Top 0.254: IC4.11 67.53,72.17 61.54,72.17 58.42,69.04 RN4.9 55.88,64.77 IC6.7
IC9
  Top 0.254: IC11.15 24.64,58.42 31.95,58.42 33.15,57.22 33.15,56.77 IC7.6
IN1-2
  Top 0.254: IC1.1 64.01,11.56 75.42,11.56 76.2,12.33 76.2,14.28 82.74,20.83 INPUT1.2
  Bottom 0.254: INPUT1.2 87.63,17.02 IN1.2
IN1-3
  Bottom 0.254: IC1.4 72.21,15.7 77.03,15.7 83.43,22.1 86.36,22.1 | IN1.3 90.17,19.56 87.63,22.1 86.36,22.1 | INPUT1.3 86.36,22.1
IN1-4
  Top 0.254: IC1.10 74.15,19.19 79.64,19.19 INPUT1.4 85.09,22.1 IN1.4
IN1-5
  Top 0.254: INPUT1.5 87.63,24.64 IN1.5
  Bottom 0.254: INPUT1.5 85.09,24.64 83.44,24.64 77.99,19.18 66.54,19.18 IC1.13
IN1-6
  Top 0.254: IC2.4 71.61,31.6 78.06,31.6 83.76,25.91 INPUT1.6 85.09,27.18 IN1.6
IN1-7
  Top 0.254: IC2.1 64.55,32.16 78.29,32.16 80.74,29.72 85.09,29.72 INPUT1.7 87.63,29.72 IN1.7
IN1-8
  Bottom 0.254: IN1.8 89.2,32.26 87.99,31.05 | INPUT1.8 85.09,29.72 86.75,29.72 87.99,30.97 87.99,31.05 | 87.99,31.05 79.82,39.22 74.14,39.22 IC2.10
IN1-9
  Top 0.254: IN1.9 90.17,34.8 INPUT1.9 82.19,35.16 67.08,35.16 IC2.13
IN2-2
  Bottom 0.254: 83.82,49.85 76.03,42.05 64.34,42.05 62.23,44.16 IC3.1 | 83.82,49.85 91.89,49.85 IN2.2 | INPUT2.2 83.82,49.85
IN2-3
  Bottom 0.254: IC3.4 72.77,48.64 75.74,48.64 81.07,53.98 85.09,53.98 INPUT2.3 90.04,51.56 IN2.3
IN2-4
  Top 0.254: IC3.10 74.3,55.24 INPUT2.4 85.03,54.04 92.65,54.04 IN2.4
IN2-5
  Top 0.254: IC3.13 66.57,51.54 70.27,51.54 71.12,52.39 71.12,54.27 74.46,57.61 79.12,57.61 80.1,56.63 85.21,56.63 INPUT2.5 91.57,57.78 IN2.5
IN2-6
  Top 0.254: 84.01,57.98 85.09,59.05 92.58,59.05 IN2.6 | INPUT2.6 84.01,57.98 | 84.01,57.98 77.99,64 71.62,64 IC4.4
IN2-7
  Top 0.254: IC4.1 64.56,64.56 78.81,64.56 81.77,61.59 85.09,61.59 INPUT2.7 87.76,61.72 IN2.7
IN2-8
  Bottom 0.254: IC4.10 76.2,66.04 76.2,61.27 77.14,60.33 INPUT2.8 85.09,61.59 87.84,61.59 90.51,64.26 IN2.8
IN2-9
  Top 0.254: IC4.13 64.77,69.33 67.17,66.93 82.3,66.93 INPUT2.9 90.3,66.8 IN2.9
LSRIO-CLOCK-OUTPUT
  Top 0.254: X1.4 89.38,81.28 PC-LINK.4
  Bottom 0.254: PC-LINK.4 84.28,83.82 76.2,83.82 IC9.10
LSRIO-DATA-LATCH
  Top 0.254: X1.3 91.89,78.74 PC-LINK.3
  Bottom 0.254: PC-LINK.3 89.48,78.84 86.26,78.84 IC9.4
LSRIO-INPUT-STREAM
  Top 0.254: R4.1 72.85,76.02 86.66,76.02 PC-LINK.2 89.36,76.2 X1.2
  Bottom 0.254: R4.1 69.38,77.3 69.38,90.34 OK1.6
LSRIO-OUTPUT-STREAM
  Top 0.254: IC9.13 78.73,81.27 88.58,81.27 89.84,82.54 PC-LINK.5 91.92,83.82 X1.5
N$1
  Bottom 0.254: IC1.5 C-2.2
N$2
  Bottom 0.254: R1.1 60.33,83.82 60.33,91.85 58.2,93.98 OK3.3
N$3
  Bottom 0.254: IC3.2 C-10.2
N$4
  Top 0.254: R3.2 73.03,81.28 76.2,81.28 IC9.6
N$5
  Bottom 0.254: IC4.5 72.39,59.69 C17.2
N$6
  Top 0.254: R14.2 43.26,84.38 33.1,84.38 Q1.2
  Bottom 0.254: R14.2 46.35,81.28 C31.1
N$7
  Bottom 0.254: IC1.9 74.93,23.5 C-3.2
N$8
  Top 0.254: R1.2 IC9.11
N$9
  Top 0.254: C30.2 38.73,42.55 Q2.2 46.99,42.55 R16.1
N$10
  Bottom 0.254: IC4.2 64.77,59.69 C1.2
N$11
  Top 0.254: IC4.9 76.73,71.65 83.92,71.65 C9.2
N$12
  Bottom 0.254: IC4.12 69.07,71.61 78.89,71.61 C18.2
N$13
  Bottom 0.254: R2.2 73.11,78.82 81.36,78.82 IC9.3
N$14
  Top 0.254: R3.1 60.49,81.11 40.47,81.11 OK2.3
N$16
  Top 0.254: R5.1 34.92,87.63 Q1.3
N$17
  Top 0.254: R5.2 46.35,87.98 48.55,90.17 61.59,90.17 OK1.3
N$18
  Top 0.254: R2.1 59.05,80.01 OK4.3
N$19
  Top 0.254: IC1.12 67.31,23.5 C2.2
N$20
  Bottom 0.254: IC2.2 C4.2
N$21
  Top 0.254: IC2.9 74.93,40.01 C5.2
N$22
  Bottom 0.254: IC2.12 67.31,40.01 C6.2
N$23
  Bottom 0.254: IC1.2 C-1.2
N$24
  Bottom 0.254: IC2.5 C3.2
N$25
  Bottom 0.254: IC9.1 81.28,76.2 71.42,76.2 70.62,77 70.62,85.86 IC9.8 74.93,95.89 R6.2
N$27
  Bottom 0.254: R12.2 44.45,93.34 LED2.K
N$28
  Top 0.254: R13.2 17.14,86.36 LED1.K
N$39
  Bottom 0.254: IC3.5 C-11.2
N$40
  Bottom 0.254: IC3.9 C-12.2
N$42
  Bottom 0.254: IC3.12 C16.2
NXT595
  Bottom 0.254: IC7.9 45.59,46.86 45.59,40.54 41.16,36.1 41.16,31.49 IC8.14
NXT597
  Bottom 0.254: IC6.14 48.76,52.84 48.76,48.03 46.99,46.26 IC5.9
O12
  Top 0.254: IC11.13 24.48,65.88 41.81,65.88 IC7.15
O13
  Top 0.254: IC11.11 24.64,68.58 34.04,68.58 IC7.1
O14
  Top 0.254: IC11.8 IC7.2
O15
  Top 0.254: IC11.6 32.77,59.69 IC7.3
O16
  Bottom 0.254: IC11.4 33.15,56.77 33.15,57.53 IC7.4
O17
  Top 0.254: IC11.2 33.33,51.87 33.33,52.33 34.34,53.34 36.31,53.34 37.07,54.1 37.07,55.39 IC7.5
O19
  Bottom 0.254: IC11.17 24.64,53.34 34.04,53.34 IC7.7
O22
  Top 0.254: IC10.13 24.48,33.37 41.81,33.37 IC8.15
O23
  Top 0.254: IC10.11 24.64,36.07 34.04,36.07 IC8.1
O24
  Top 0.254: IC10.8 IC8.2
O25
  Top 0.254: IC10.6 32.77,27.18 IC8.3
O26
  Bottom 0.254: IC10.4 33.15,24.26 33.15,25.02 IC8.4
O27
  Top 0.254: IC10.2 33.15,19.18 33.15,19.64 34.46,20.95 36.4,20.95 37.07,21.62 37.07,22.87 IC8.5
O28
  Top 0.254: IC10.15 24.64,25.91 31.95,25.91 33.15,24.71 33.15,24.26 IC8.6
O29
  Bottom 0.254: IC10.17 24.64,20.83 34.04,20.83 IC8.7
OP12
  Top 0.254: IC11.7 29.72,63.5 OUTPUT1.2 12.7,67.31 OUT1.2
OP13
  Bottom 0.254: IC11.9 29.88,68.42 22.22,68.42 20.27,66.47 20.27,65.64 16.86,62.23 15.24,62.23 OUTPUT1.3 10.16,64.77 OUT1.3
OP14
  Top 0.254: OUTPUT1.4 15.24,62.23 OUT1.4
  Bottom 0.254: IC11.12 22.86,67.31 OUTPUT1.4
OP15
  Top 0.254: IC11.14 20.83,59.69 15.24,59.69 OUTPUT1.5 12.7,59.69 OUT1.5
OP16
  Top 0.254: OUT1.6 15.24,57.15 OUTPUT1.6 22.1,58.42 IC11.16
OP17
  Top 0.254: OUTPUT1.7 13.91,55.82 8.07,55.82 OUT1.7
  Bottom 0.254: OUTPUT1.7 15.11,54.74 20.7,54.74 IC11.18
OP18
  Top 0.254: IC11.5 29.72,55.88 OUTPUT1.8 15.24,54.61 11.98,54.61 9.44,52.07 OUT1.8
OP19
  Top 0.254: IC11.3 29.72,53.34 20.04,53.34 18.89,54.49 15.91,54.49 14.76,53.34 OUTPUT1.9 10.16,49.53 OUT1.9
OP22
  Top 0.254: IC10.7 29.72,30.99 OUTPUT2.2 12.7,34.8 OUT2.2
OP23
  Bottom 0.254: IC10.9 29.88,35.91 22.18,35.91 19.7,33.43 19.7,32.52 16.9,29.72 15.24,29.72 OUTPUT2.3 10.16,32.26 OUT2.3
OP24
  Top 0.254: OUTPUT2.4 15.24,29.72 OUT2.4
  Bottom 0.254: IC10.12 22.86,34.8 OUTPUT2.4
OP25
  Top 0.254: IC10.14 20.83,27.18 15.24,27.18 OUTPUT2.5 12.7,27.18 OUT2.5
OP26
  Top 0.254: OUTPUT2.6 22.1,25.91 IC10.16
  Bottom 0.254: OUTPUT2.6 15.24,24.64 OUT2.6
OP27
  Top 0.254: OUTPUT2.7 13.91,23.31 8.07,23.31 OUT2.7
  Bottom 0.254: OUTPUT2.7 15.11,22.23 20.7,22.23 IC10.18
OP28
  Top 0.254: OUT2.8 9.44,19.56 11.98,22.1 15.24,22.1 OUTPUT2.8 29.72,23.37 IC10.5
OP29
  Top 0.254: IC10.3 29.72,20.83 20.04,20.83 18.89,21.98 15.91,21.98 14.76,20.83 OUTPUT2.9 10.16,17.02 OUT2.9
RCLK
  Top 0.254: IC8.12 45.47,27.18 IC5.12 50.62,30.81 50.62,40.64 | Q2.3 44.97,41.8 49.47,41.8 50.62,40.64 | R15.2 50.62,40.64 | IC6.12 45.47,59.69 IC7.12
  Bottom 0.254: IC7.12 41.17,55.4 41.17,45.5 44.45,42.23 Q2.3
SRCLK
  Top 0.254: IC6.11 48.75,60.47 48.75,59.17 48,58.42 46.05,58.42 44.96,57.32 44.96,56.64 IC7.11 | R10.1 28.57,78.74 48.9,78.74 OK4.6
  Bottom 0.254: IC8.11 44.68,23.85 44.68,27.41 IC5.11 45.18,31.53 45.18,37.54 46.2,38.57 46.2,48.09 44.96,49.33 44.96,52.58 IC7.11 | OK4.6 49.84,80.01 47.53,77.7 47.53,75.83 45.23,73.53 45.23,63.99 IC6.11
SRLD
  Top 0.254: OK2.6 29.84,80.01 R9.1
  Bottom 0.254: 41.82,58.31 38.73,55.23 38.73,45.09 C30.1 | 41.82,58.31 45.83,58.31 IC6.13 50.8,53.34 50.8,51.09 58.08,43.81 R16.2 59.55,42.69 59.55,40.14 57.42,38.02 55.63,38.02 50.8,33.19 50.8,28.45 IC5.13 | OK2.6 32.84,78.92 32.84,72.31 37.49,67.66 37.49,62.64 41.82,58.31
V5
  Top 0.254: R10.2 18.41,77.47 C8.2 22.05,76.03 30.65,76.03 OK2.8 35.56,74.93 C12.2 | INPUT1.10 80.38,34.43 65.26,34.43 IC2.14 | C23.2 40.01,37.72 IC8.16 45.47,32.26 | 49.53,14.48 C19.2 | 49.53,14.48 IC5.16 44.45,19.56 IC8.10 41.14,21.34 41.14,27.67 41.92,28.45 43.86,28.45 44.96,29.54 44.96,31.75 45.47,32.26 | RN1.1 57.96,15.06 50.12,15.06 49.53,14.48 | 42.93,51.82 45.21,49.53 IC6.16 49.6,46.92 | 42.93,51.82 C22.2 36.76,45.65 27.87,45.65 C25.2 23.37,43.81 | IC7.10 42.93,51.82 | RN4.1 57.93,47.48 50.16,47.48 49.6,46.92 | 49.6,46.92 49.6,46.43 C14.2 | C21.2 23.37,43.81 | 23.37,43.81 IC11.20 | 17.14,82.9 14.12,82.9 5V.1 4.77,84.14 ..2 | V5.1 22.86,88.61 17.14,82.9 | 17.14,82.9 R9.2 | C10.2 16,96.52 C7.+ | DC1.2 31.11,97.16 LED1.A | 45.47,32.26 IC5.10 | IC4.14 66.6,65.48 81.2,65.48 INPUT2.10 | IC6.10 45.47,64.77 IC7.16 | OK3.8 52.07,88.9 C13.2 | OUTPUT2.10 22.86,14.48 IC10.20
  Bottom 0.254: OK3.8 47.74,86.47 47.74,82.08 48.54,81.28 50.44,81.28 51.28,80.44 51.28,76.05 OK4.8 C32.2 50.16,67.94 | C14.2 49.53,41.91 R15.1 49.53,39.37 C15.2 49.53,34.8 IC5.10 | C13.2 55.24,92.99 57.35,95.09 61.75,95.09 OK1.2 | 62.23,66.22 51.9,66.22 50.16,67.94 | 62.23,66.22 63.33,65.12 63.33,59.85 62.23,58.76 IC3.14 62.23,50.8 RN4.1 61.59,43.81 C20.2 62.7,42.07 62.7,37.94 IC2.14 | IC4.14 62.23,66.22 | IC6.10 50.16,67.94 | 25.4,12.45 C27.2 | IC10.20 25.4,12.45 | 25.4,12.45 25.82,12.86 38.9,12.86 C24.2 40.01,16.64 IC8.10 | 22.86,95.25 C10.2 | V5.1 22.86,95.25 | LED1.A 24.77,97.16 22.86,95.25 | OUTPUT1.10 22.86,46.99 IC11.20 | C26.2 C25.2 | DC1.2 C11.2 | IC7.16 40.64,69.6 C12.2 | R9.2 R11.2 R10.2 | RN1.1 62.23,18.41 IC1.14

### Text on the board
tValues: GND / 0 / 1 / 2 / 3 / 4 / 5 / 6 / 7 / GND | GND / 15 / 14 / 13 / 12 / 11 / 10 / 9 / 8 / GND | <- OUTPUT | INPUT <- | GND / 8 / 9 / 10 / 11 / 12 / 13 / 14 / 15 / GND | GND / 7 / 6 / 5 / 4 / 3 / 2 / 1 / 0 / GND | Rev D 2024-07-11 | 153-03 LinuxCNC optically isolated LSRIO port expander | License: CERN-OHL-P V2 info@virtualsilicon.ch
Document: +5V | GND | Input range / -30 <-> +30V | 35 mA/pin max